# Altium schematic sheet 06_STARNOTE-CONNECTION.SchDoc
size 420 x 297 mm; Web: www.byte-lab.com; PageNumber: 06
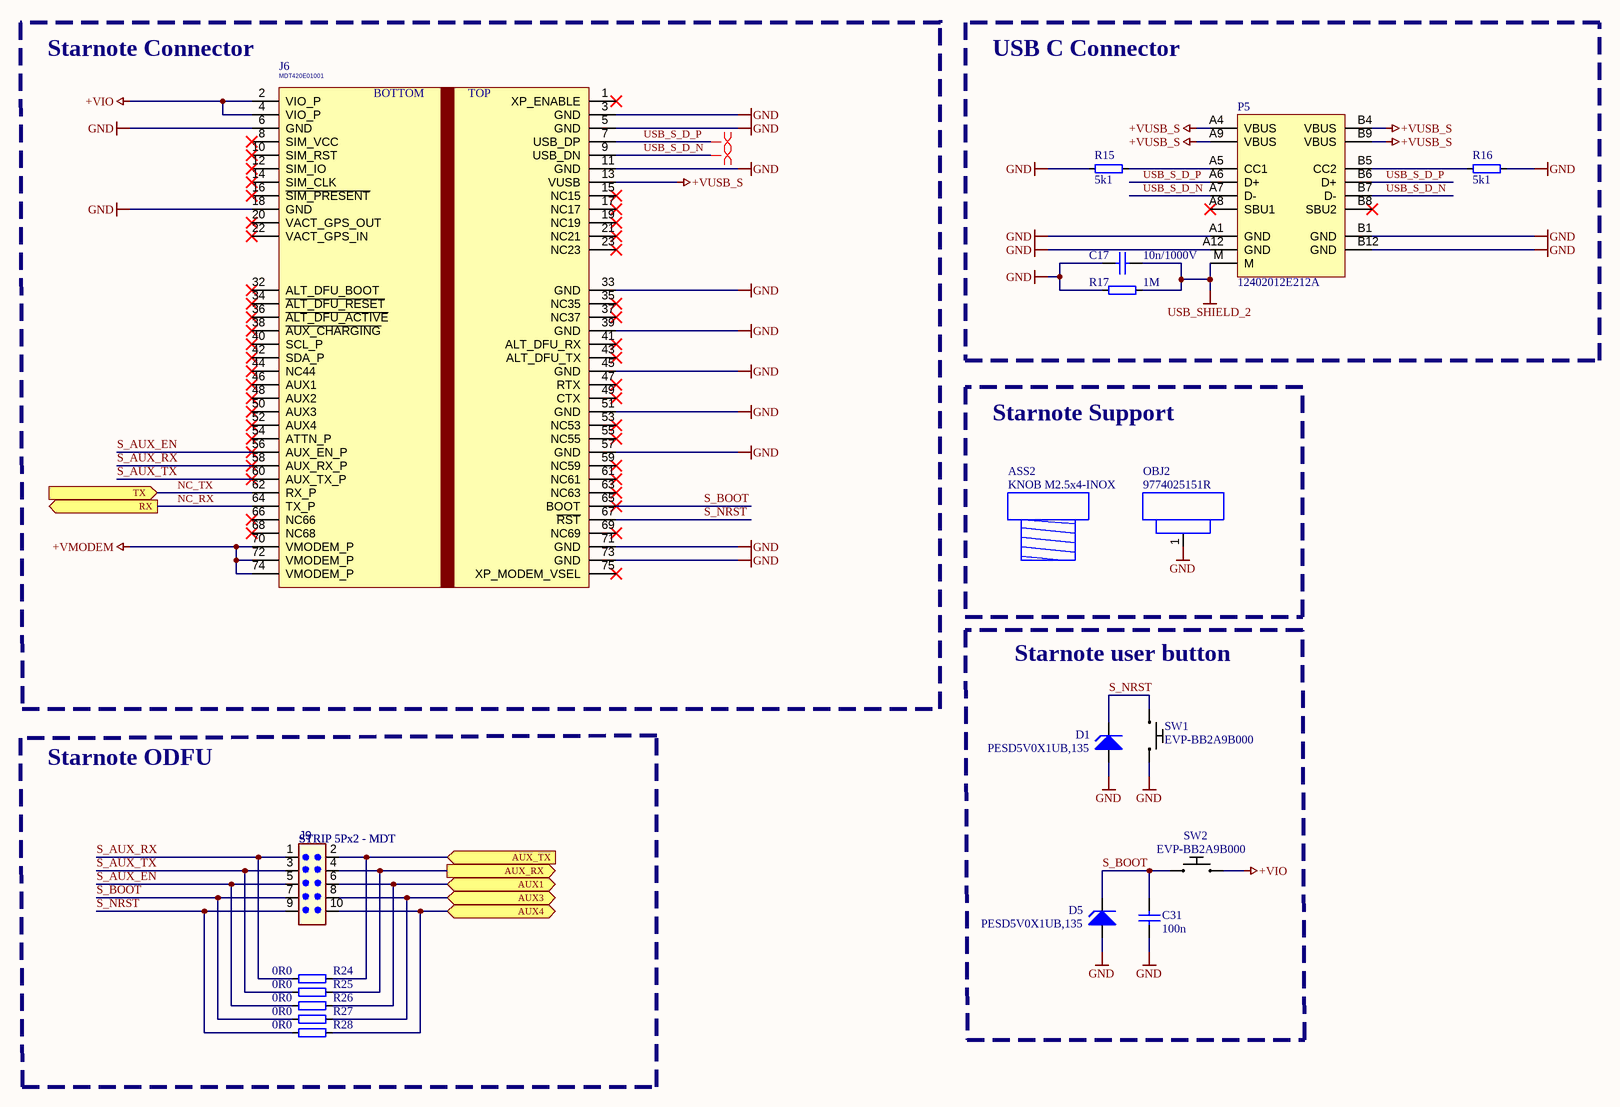
[diagram p0: 06_STARNOTE-CONNECTION.SchDoc]

## Parts
?  (no value)  (graphical)
ASS2  KNOB M2.5x4-INOX  (mechanical)
C17  10n/1000V  [C-1206]
C31  100n  [C-0402]
D1  PESD5V0X1UB,135  [SOD-523F]
D5  PESD5V0X1UB,135  [SOD-523F]
J6  MDT420E01001  [J-75-0050-MOS-M2 - STARNOTEIV3]
J9  STRIP 5Px2 - MDT  [J-5X2-0254-MDT]
OBJ2  9774025151R  [DIST-WASMSIM0250]
P5  12402012E212A  [CONN_12402012E212A]
R15  5k1  [R-0402]
R16  5k1  [R-0402]
R17  1M  [R-1206]
R24  0R0  [R-0603]
R25  0R0  [R-0603]
R26  0R0  [R-0603]
R27  0R0  [R-0603]
R28  0R0  [R-0603]
SW1  EVP-BB2A9B000  [SW_EVP-BB2A9B000]
SW2  EVP-BB2A9B000  [SW_EVP-BB2A9B000]

## Blocks framed on the sheet
USB C Connector: C17 P5 R15-R17
Starnote Support: ASS2 OBJ2
Starnote user button: C31 D1 D5 SW1 SW2
Starnote ODFU: J9 R24-R28

## Ports
AUX1 (bidir), AUX3 (bidir), AUX4 (bidir), AUX_RX (out), AUX_TX (in), RX (out), TX (in)

## Nets
+VIO: J6.2(VIO_P) J6.4(VIO_P) SW2.2(B)
+VMODEM: J6.70(VMODEM_P) J6.72(VMODEM_P) J6.74(VMODEM_P)
+VUSB_S: J6.13(VUSB) P5.A4(VBUS) P5.A9(VBUS) P5.B4(VBUS) P5.B9(VBUS)
GND: C17.2 C31.2 D1.1(A) D5.1(A) J6.3(GND) J6.5(GND) J6.6(GND) J6.11(GND) J6.18(GND) J6.33(GND) J6.39(GND) J6.45(GND) J6.51(GND) J6.57(GND) J6.71(GND) J6.73(GND) OBJ2.1 P5.A1(GND) P5.A12(GND) P5.B1(GND) P5.B12(GND) R15.1 R16.2 R17.2 SW1.2(B)
USB_SHIELD_2: C17.1 P5.M R17.1
AUX1: J9.6 R26.2 ; port AUX1
AUX3: J9.8 R27.2 ; port AUX3
AUX4: J9.10 R28.2 ; port AUX4
AUX_RX: J9.4 R25.2 ; port AUX_RX
AUX_TX: J9.2 R24.2 ; port AUX_TX
NC_RX: J6.64(TX_P) ; port RX
NC_TX: J6.62(RX_P) ; port TX
S_AUX_EN: J6.56(AUX_EN_P) J9.5 R26.1
S_AUX_RX: J6.58(AUX_RX_P) J9.1 R24.1
S_AUX_TX: J6.60(AUX_TX_P) J9.3 R25.1
S_BOOT: C31.1 D5.2(K) J6.65(BOOT) J9.7 R27.1 SW2.1(A)
S_NRST: D1.2(K) J6.67(~{RST}) J9.9 R28.1 SW1.1(A)
USB_S_D_N: J6.9(USB_DN) P5.A7(D-) P5.B7(D-)
USB_S_D_P: J6.7(USB_DP) P5.A6(D+) P5.B6(D+)
NetP5_A5: P5.A5(CC1) R15.2
NetP5_B5: P5.B5(CC2) R16.1

Not connected (* = marked no-connect by the designer): J6 1(XP_ENABLE)* 8(SIM_VCC)* 10(SIM_RST)* 12(SIM_IO)* 14(SIM_CLK)* 15(NC15)* 16(~{SIM_PRESENT})* 17(NC17)* 19(NC19)* 20(VACT_GPS_OUT)* 21(NC21)* 22(VACT_GPS_IN)* 23(NC23)* 32(ALT_DFU_BOOT)* 34(~{ALT_DFU_RESET})* 35(NC35)* 36(~{ALT_DFU_ACTIVE})* 37(NC37)* 38(~{AUX_CHARGING})* 40(SCL_P)* 41(ALT_DFU_RX)* 42(SDA_P)* 43(ALT_DFU_TX)* 44(NC44)* 46(AUX1)* 47(RTX)* 48(AUX2)* 49(CTX)* 50(AUX3)* 52(AUX4)* 53(NC53)* 54(ATTN_P)* 55(NC55)* 59(NC59)* 61(NC61)* 63(NC63)* 66(NC66)* 68(NC68)* 69(NC69)* 75(XP_MODEM_VSEL)*; P5 A8(SBU1)* B8(SBU2)*

## Layout directives
differential pair: USB_S_D_N, USB_S_D_P

## Notes on the sheet
- (near J6) Starnote Connector
- Board
- Project
- Page name
- Project Code
- Designer
- Internal Code
- Approved
- Customer
- Code
- Il presente progetto è tutelato dalla legge sul diritto d'autore, che vieta a terzi la riproduzione e l'utilizzo anche parziale senza il consenso di FAE Technology S.p.A.
- Data
- Rev.
- Rev. changes
- Sheet
- /
- (in symbol STARNOTEI-V3) BOTTOM; TOP

## Library data of the parts
? = MyFAETechnology
ASS2 = KNOB - M2.5x4-INOX: VITE TCEI 2.5X4 ESAGONO INCASSATO A2 INOX; Manufacturer Part Number: M2.5X4/D7985-A2; Manufacturer: KRAFTBERG; BL Part Number: 6000-168; Drawn_By: Blues Wireless; Supplier Part Number 1: M2.5X4/D7985-A2; Supplier 1: TME
C17 = C1206-10n-1000V-X7R - CS1206KKX7RCBB103: Capacitor ceramic 10n ±10% X7R 1000V 1206; BL Part Number: 2007-449; Manufacturer: YAGEO; Drawn_By: Hamin; Checked_By: Marsic; Manufacturer Part Number: CS1206KKX7RCBB103; DateModified: 03-05-2023; Supplier 1: Digi-Key; Supplier Part Number 1: 311-3578-1-ND; Note: *
C31 = C0402-100n-16V-X7R: Capacitor ceramic 100n ±10% X7R 16V 0402; BL Part Number: 2000-908; Manufacturer: Murata Electronics; Manufacturer Part Number: GRM155R71C104KA88D; Drawn_By: Puskar; Checked_By: Dodig; Pkg Type: SMD; DateModified: 27-08-2013; Supplier 1: Digi-Key; Supplier Part Number 1: 490-3261-1-ND; Note: *; Package: 0402
D1 D5 = PESD5V0X1UB,135: TVS DIODE 5VWM 8VC SOD523; BL Part Number: 2004-110; Manufacturer: Nexperia; Drawn_By: Zvonc; Checked_By: Hamin; Manufacturer Part Number: PESD5V0X1UB,135; DateModified: 17-10-2018; Supplier 1: Digi-Key; Supplier Part Number 1: 1727-5906-1-ND
J6 = STARNOTEI-V3: CONN. M.2 75P M/90° P=0.5 MDT420E01001 AMPHENOL SMT; Manufacturer: Amphenol ICC (FCI); Manufacturer Part Number: MDT420E03001; BL Part Number: 2007-460; Drawn_By: Blues Wireless; Supplier 1: Digi-Key; Supplier Part Number 1: MDT420E03001CT-ND
J9 = STRIP-J-5X2-0254-MDT: STRIP 2P M/D DOPPIA FILA P=2.54 DORATO CH81802V100; MPN: TSW-105-07-F-D; Manufacturer: Samtec; Pkg Type: THT; Famiglia: CONNETTORE; Database: 01688; Caratteristiche: 5x2P; Price Distributor Cad: 0,002; Modello: STRIP; Distributor: FAE; Value: STRIP 5Px2 - MDT
OBJ2 = DISTANZIALE - M2.5x0250: DISTANZ. CIL. METALLO 5.1X2.5 9774025151R W.E SMT; Manufacturer: Würth Elektronik; BL Part Number: 6020-113; Drawn_By: Blues Wieless; Supplier 1: Digi-Key; Supplier Part Number 1: 732-7078-1-ND; Manufacturer Part Number: 9774025151R
P5 = Conn USB C 12402012E212A: CONN RCP USB2.0 TYP C 24P SMD RA; BL Part Number: 2008-437; Manufacturer: Amphenol; Drawn_By: Anic-Ivicic; Checked_By: Hlupic; Note: *; Manufacturer Part Number: 12402012E212A; DateModified: 19-03-2024; Supplier 1: Digi-Key; Supplier Part Number 1: 664-12402012E212ATR-ND
R15 R16 = R0402-5k1-1: Resistor 5k1 ±1% 0402; Manufacturer Part Number: RC0402FR-075K1L; Manufacturer: YAGEO; BL Part Number: 2004-098; Checked_By: Hamin; Drawn_By: PuskarJ; Pkg Type: SMD; DateModified: 21-09-2018; Note: *; Supplier 1: Digi-Key; Supplier Part Number 1: P5.10KLCT-ND; Package: 0402
R17 = R1206-1M-1: Resistor 1M ±1% 1206; Manufacturer Part Number: CRG1206F1M0; Manufacturer: TE Connectivity Passive Product; BL Part Number: 2001-438; Checked_By: Golubic; Drawn_By: Zvonc; Pkg Type: SMD; DateModified: 01-07-2014; Package: 1206
R24-R28 = R0603-0R0: Resistor 0R0 0603; Manufacturer Part Number: RC0603JR-070RL; Manufacturer: YAGEO; BL Part Number: 2000-723; Checked_By: Puskar; Drawn_By: Dodig; Pkg Type: SMD; DateModified: 07-12-2013; Note: *; Package: 0603
SW1 SW2 = Switch tact EVP-BB2A9B000: SWITCH TACTILE SPST-NO 0.05A 15V; Manufacturer: Panasonic Electronic Components; BL Part Number: 2007-124; Drawn_By: Marsic; Manufacturer Part Number: EVP-BB2A9B000; Note: *; DateModified: 09-02-2023; Checked_By: *